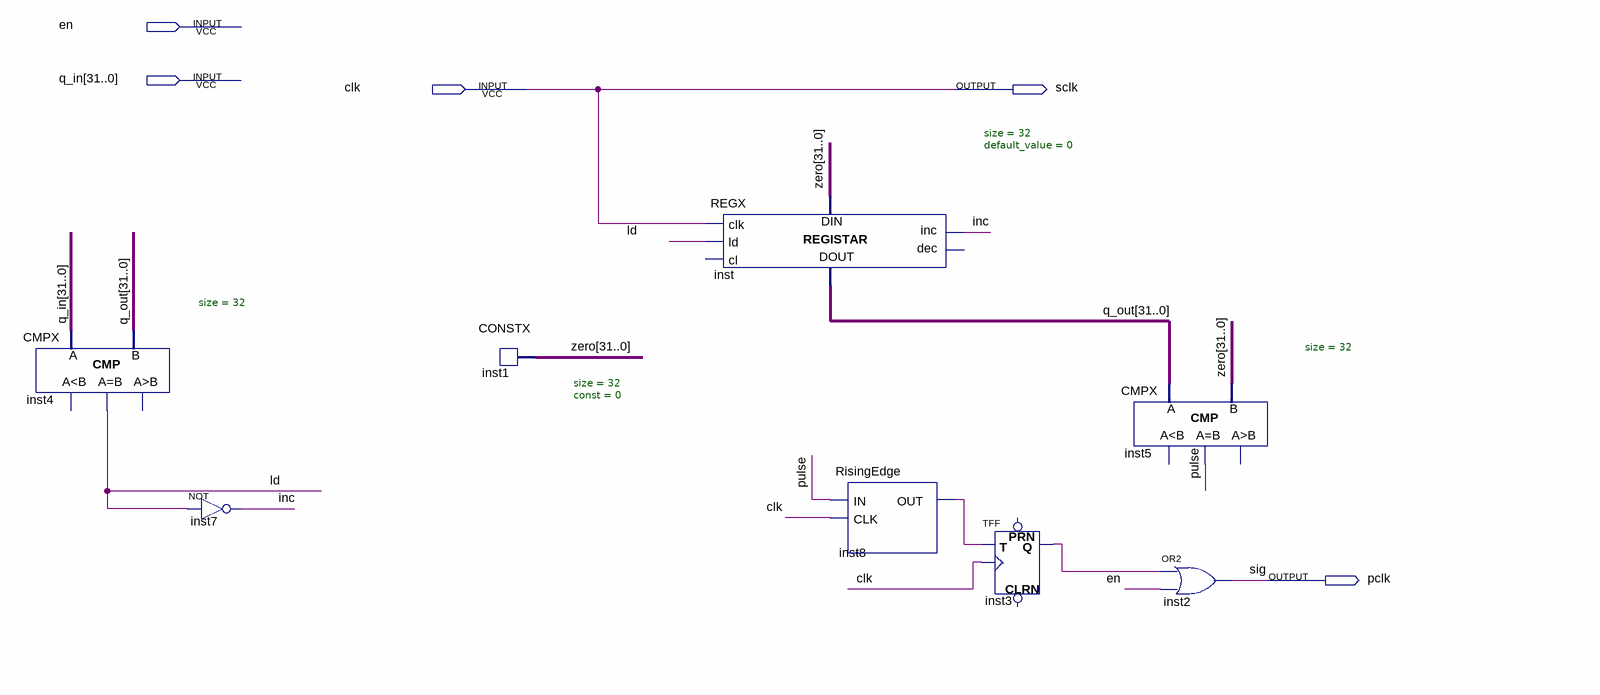
[diagram p0: schematic sheet]
// Quartus schematic PLL_32b.bdf as structural Verilog: 8 symbols, 5 pins
module PLL_32b (
  input  en,
  input  [31:0] q_in,
  input  clk,
  output sclk,
  output pclk
);

  wire inc, inst3_q, inst8_out, ld, pulse;
  wire [31:0] q_out, zero;

  CMPX #(.size(32)) inst4 (.A(q_in), .B(q_out), .eq(ld));  // open: ls, gr
  not inst7 (inc, ld);
  CONSTX #(.size(32), .\const (0)) inst1 (.data(zero));
  REGX #(.size(32), .default_value(0)) inst (
    .clk(clk), .ld(ld), .inc(inc), .data_in(zero), .data_out(q_out));  // open: cl, dec
  RisingEdge inst8 (.IN(pulse), .CLK(clk), .OUT(inst8_out));
  TFF inst3 (.T(inst8_out), .CLK(clk), .Q(inst3_q));  // open: PRN, CLRN
  CMPX #(.size(32)) inst5 (.A(q_out), .B(zero), .eq(pulse));  // open: ls, gr
  or inst2 (pclk, inst3_q, en);

  assign sclk = clk;

  // Other names for the same wires on the sheet: sig = pclk
endmodule
